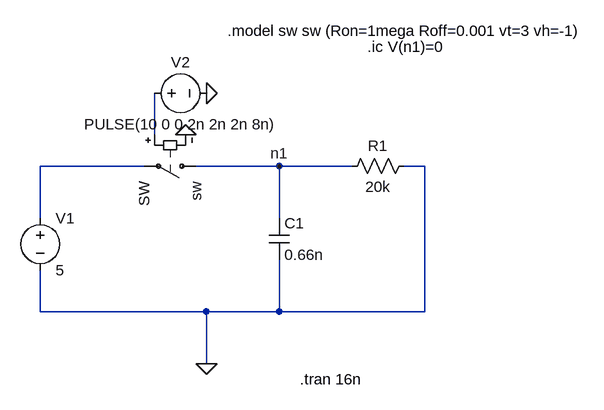
[diagram p0: schematic something_s.asc]
something_s.asc, the LTspice schematic file:
Version 4
SHEET 1 880 680
WIRE -256 -48 -256 -112
WIRE -272 0 -432 0
WIRE -64 0 -192 0
WIRE 48 0 -64 0
WIRE 160 0 128 0
WIRE -432 80 -432 0
WIRE -64 80 -64 0
WIRE -432 224 -432 160
WIRE -176 224 -432 224
WIRE -64 224 -64 144
WIRE -64 224 -176 224
WIRE 160 224 160 0
WIRE 160 224 -64 224
WIRE -176 304 -176 224
FLAG -64 0 n1
FLAG -176 304 0
FLAG -176 -112 0
FLAG -208 -48 0
SYMBOL cap -80 80 R0
SYMATTR InstName C1
SYMATTR Value 0.66n
SYMBOL voltage -432 64 R0
WINDOW 123 0 0 Left 0
WINDOW 39 0 0 Left 0
SYMATTR InstName V1
SYMATTR Value 5
SYMBOL res 144 -16 R90
WINDOW 0 0 56 VBottom 2
WINDOW 3 32 56 VTop 2
SYMATTR InstName R1
SYMATTR Value 20k
SYMBOL sw -176 0 R90
SYMATTR InstName sw
SYMBOL voltage -272 -112 R270
WINDOW 0 32 56 VTop 2
WINDOW 3 -32 56 VBottom 2
WINDOW 123 0 0 Left 0
WINDOW 39 0 0 Left 0
SYMATTR InstName V2
SYMATTR Value PULSE(10 0 0 2n 2n 2n 8n)
TEXT -32 328 Left 2 !.tran 16n
TEXT -144 -208 Left 2 !.model sw sw (Ron=1mega Roff=0.001 vt=3 vh=-1)
TEXT 72 -184 Left 2 !.ic V(n1)=0

The netlist it stands for:
* something_s.asc
C1 n1 0 0.66n
V1 N002 0 5
R1 0 n1 20k
sw n1 N002 N001 0 SW
V2 N001 0 PULSE(10 0 0 2n 2n 2n 8n)
.tran 16n
.model sw sw (Ron=1mega Roff=0.001 vt=3 vh=-1)
.ic V(n1)=0
.backanno
.end